# EAGLE design SelfBus JTAG_SWD Adapter (EAGLE 9.6.2)
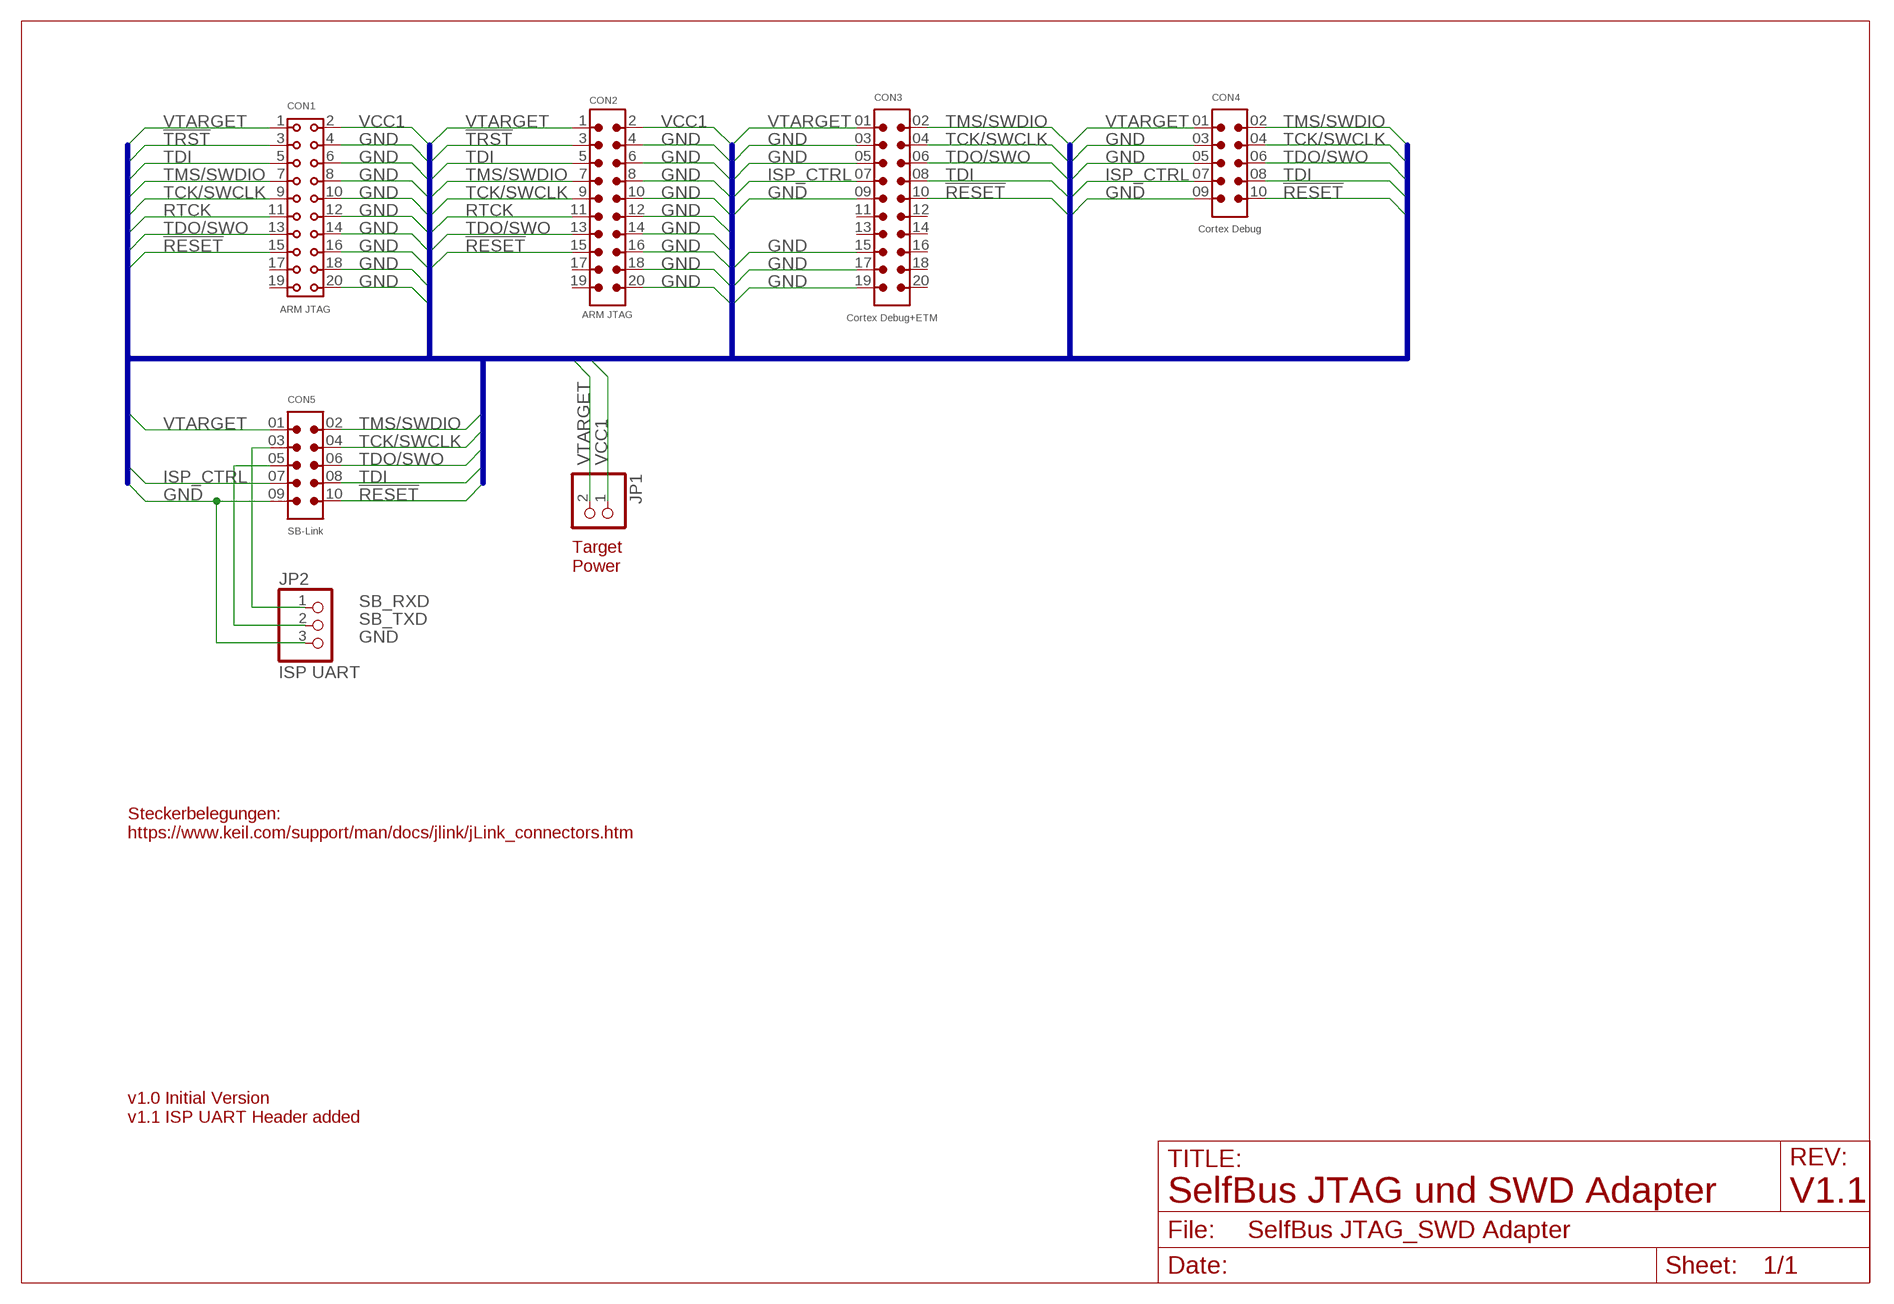
[diagram p0: schematic, sheet 1]

## Parts
CON1  ARM JTAG  SAMTEC-SSQ-110-02-X-D-RA  [SAMTEC-SSQ-110-02-X-D-RA]
CON2  ARM JTAG  6120XX21721_61202021721  [61202021721]
CON3  Cortex Debug+ETM  SHF-110-01-L-D-TH  [SAMTEC_SHF-110-01-L-D-TH]
CON4  Cortex Debug  SHF-105-01-X-D-TH  [SAMTEC_SHF-105-01-X-D-TH]
CON5  SB-Link  SAMTEC-LTMM-105-02-T-D  [SAMTEC-LTMM-105-02-T-D]
JP1  Target Power  PINHD-1X2  [1X02]
JP2  ISP UART  PINHD-1X3  [1X03]

## Nets
!RESET: CON1.15 CON2.15 CON3.10 CON4.10 CON5.10
!TRST: CON1.3 CON2.3
GND: CON1.4 CON1.6 CON1.8 CON1.10 CON1.12 CON1.14 CON1.16 CON1.18 CON1.20 CON2.4 CON2.6 CON2.8 CON2.10 CON2.12 CON2.14 CON2.16 CON2.18 CON2.20 CON3.03 CON3.05 CON3.09 CON3.15 CON3.17 CON3.19 CON4.03 CON4.05 CON4.09 CON5.09 JP2.3
ISP_CTRL: CON3.07 CON4.07 CON5.07
RTCK: CON1.11 CON2.11
SB_RXD: CON5.03 JP2.1
SB_TXD: CON5.05 JP2.2
TCK/SWCLK: CON1.9 CON2.9 CON3.04 CON4.04 CON5.04
TDI: CON1.5 CON2.5 CON3.08 CON4.08 CON5.08
TDO/SWO: CON1.13 CON2.13 CON3.06 CON4.06 CON5.06
TMS/SWDIO: CON1.7 CON2.7 CON3.02 CON4.02 CON5.02
VCC1: CON1.2 CON2.2 JP1.1
VTARGET: CON1.1 CON2.1 CON3.01 CON4.01 CON5.01 JP1.2
Unconnected: CON1.17 CON1.19 CON2.17 CON2.19 CON3.11 CON3.12 CON3.13 CON3.14 CON3.16 CON3.18 CON3.20

## Buses
JTAG:DBGACK,DBGRQ,GND,ISP_CTRL,!RESET,RTCK,TCK/SWCLK,TDI,TDO/SWO,TMS/SWDIO,!TRST,VCC1,VTARGET

## Notes on the sheet
- Target
  Power
- Steckerbelegungen:
  https://www.keil.com/support/man/docs/jlink/jLink_connectors.htm
- v1.0 Initial Version
  v1.1 ISP UART Header added
- SelfBus JTAG und SWD Adapter | V1.1

## Library data of the parts
CON1 = MyCon-Samtec:SAMTEC-SSQ-110-02-X-D-RA; LCSC2#: C124406; MOUSER#: 200-SSQ11002TDRA; PART#: Samtec SSQ-110-02-T-D-RA; PART2#: Ckmtw(Shenzhen Cankemeng) C124406
CON2 = MyCon-Würth:6120XX21721_61202021721: WR-BHD 2.54 mm Male Angled Box Header KIND PROPERTIES: Pitch 2.54 mm Gender:Male MATERIAL PROPERTIES: Insulator Material:PBT Insulator Flammability Rating UL94 V-0 Insulator Color:Black Contact Material :Copper Alloy Contact Plating :Gold Contact Type: Stamped GENERAL INFORMATION: Operating Temperature:-40 °C up to +125 °C Compliance:RoHS Working Voltage: 250 V (AC) Withstanding Voltage:500 V (AC) Contact Resistance: 20 mΩ Insulation Resistance:1000 MΩ CERTIFICATION: UL Approval:E323964 PACKAGING PROPERTIES Packaging :Tray <https://katalog.we-online.com/media/images/v2/o32888v209%20Family_WR-BHD_6120xx21721.jpg> Details see: https://katalog.we-online.com/en/em/BHD_2_54_MALE_ANGLED_BOX_HEADER_6120XX21721 Updated by Yingchun,Shan 2019-10-29 2019 (C) Würth Elektronik; LCSC3#: C9144; MOUSER#: 710-61202021721; MOUSER2#: 517-30320-5002; PART#: Würth 61202021721; PART2#: 3M 30320-5002HB; PART3#: BOOMELE(Boom Precision Elec) C9144
CON3 = MyCon-Samtec:SHF-110-01-L-D-TH; MOUSER#: 200-SHF11001LDTH; PART#: SHF-110-01-L-D-TH
CON4 = MyCon-Samtec:SHF-105-01-X-D-TH: Connector Header Through Hole 10 position 0.050" (1.27mm); LCSC2#: C239059; MOUSER#: 200-SHF10501LDTH; PART#: SHF-105-01-L-D-TH; PART2#: Amphenol ICC 20021111-00010T4LF
CON5 = MyCon-Samtec:SAMTEC-LTMM-105-02-T-D; LCSC3#: C5661; MOUSER#: 200-LTMM10502TD; MOUSER2#: 538-87831-1020; PART#: Samtec LTMM-105-02-T-D; PART2#: Molex 87831-1020; PART3#: BOOMELE(Boom Precision Elec) C5661
JP1 = pinhead:PINHD-1X2: PIN HEADER
JP2 = pinhead:PINHD-1X3: PIN HEADER

## Board
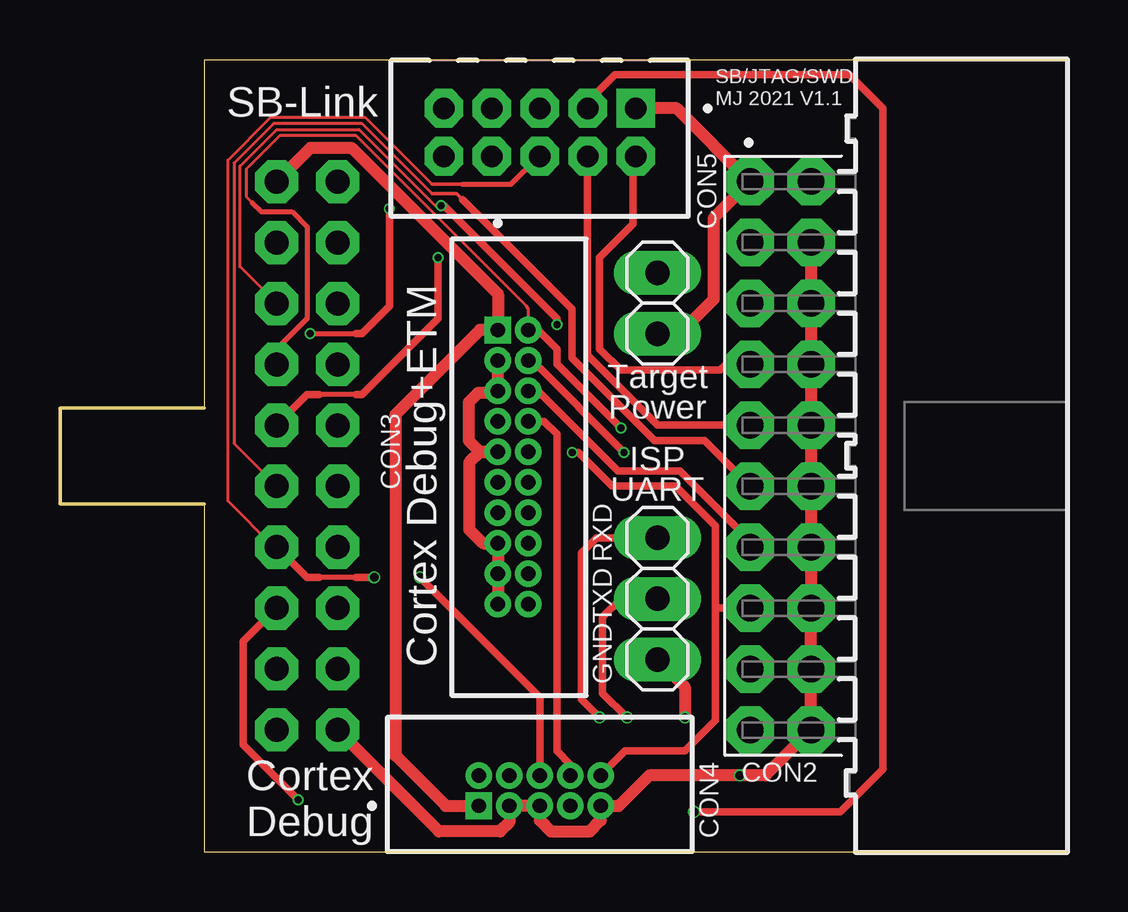
[diagram p1: board, top side]
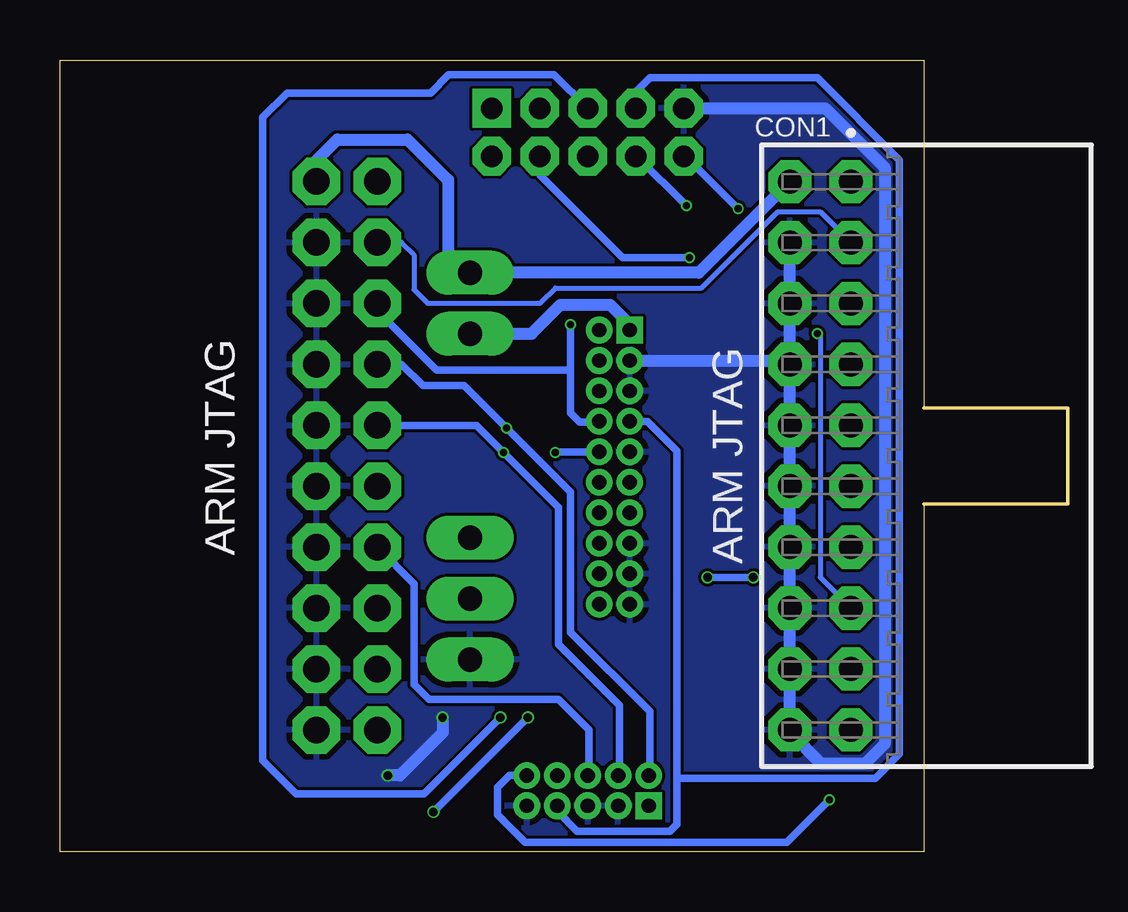
[diagram p2: board, bottom side, seen from below]

Size 42 x 33 mm. Coordinates in mm from the lower left corner, seen from the top.
Outline: 6,0 42,0 42,33 6,33 6,18.5 0,18.5 0,14.5 6,14.5 6,0
Copper layers (1*16): Top 0.035mm / dielectric 1.6mm / Bottom 0.035mm
Design rules "jlcpcb-2layers": minimum track width 5mil, minimum drill 0.3mm, track to track 5mil, track to pad 5mil, pad to pad 5mil, via to via 5mil, smd to smd 5mil, copper to edge 0.2mm, drill to drill 6mil, minimum pad ring 10mil, minimum via ring 3mil, stop-mask expansion 4mil, vias tented up to drill 0mil, thermal gap 10mil

### Footprints (pad centres in the part's own frame; a part is rotated, then mirrored left to right if it is on the bottom)
SAMTEC-SSQ-110-02-X-D-RA = drill 1 pad 1.676 octagon: 1 0,0; 2 0,-2.54; 3 2.54,0; 4 2.54,-2.54; 5 5.08,0; 6 5.08,-2.54; 7 7.62,0; 8 7.62,-2.54; 9 10.16,0; 10 10.16,-2.54; 11 12.7,0; 12 12.7,-2.54; 13 15.24,0; 14 15.24,-2.54; 15 17.78,0; 16 17.78,-2.54; 17 20.32,0; 18 20.32,-2.54; 19 22.86,0; 20 22.86,-2.54
61202021721 = drill 1.1 pad 1.676 octagon: 1 11.43,8.805; 2 11.43,6.265; 3 8.89,8.805; 4 8.89,6.265; 5 6.35,8.805; 6 6.35,6.265; 7 3.81,8.805; 8 3.81,6.265; 9 1.27,8.805; 10 1.27,6.265; 11 -1.27,8.805; 12 -1.27,6.265; 13 -3.81,8.805; 14 -3.81,6.265; 15 -6.35,8.805; 16 -6.35,6.265; 17 -8.89,8.805; 18 -8.89,6.265; 19 -11.43,8.805; 20 -11.43,6.265
SAMTEC_SHF-110-01-L-D-TH = drill 0.6 square: 01 0,0 | drill 0.6: 02 0,1.27; 03 1.27,0; 04 1.27,1.27; 05 2.54,0; 06 2.54,1.27; 07 3.81,0; 08 3.81,1.27; 09 5.08,0; 10 5.08,1.27; 11 6.35,0; 12 6.35,1.27; 13 7.62,0; 14 7.62,1.27; 15 8.89,0; 16 8.89,1.27; 17 10.16,0; 18 10.16,1.27; 19 11.43,0; 20 11.43,1.27
SAMTEC_SHF-105-01-X-D-TH = drill 0.6 square: 01 -2.54,-0.635 | drill 0.6: 02 -2.54,0.635; 03 -1.27,-0.635; 04 -1.27,0.635; 05 0,-0.635; 06 0,0.635; 07 1.27,-0.635; 08 1.27,0.635; 09 2.54,-0.635; 10 2.54,0.635
SAMTEC-LTMM-105-02-T-D = drill 0.9 square: 01 -4,-1 | drill 0.9 octagon: 02 -4,1; 03 -2,-1; 04 -2,1; 05 0,-1; 06 0,1; 07 2,-1; 08 2,1; 09 4,-1; 10 4,1
1X02 = drill 1.016 long: 1 -1.27,0; 2 1.27,0
1X03 = drill 1.016 long: 1 -2.54,0; 2 0,0; 3 2.54,0

### Placement (x,y rotation side)
CON1  9.03,27.93 270 bottom
CON2  37.58,16.5 90 top
CON3  18.25,21.74 270 top
CON4  20,2.54 0 top
CON5  20,29.98 180 top
JP1  24.91,22.86 270 top
JP2  24.91,10.54 270 top

### Tracks (layer width: path | path; a pad name or v marks a point on that pad's centre or on a via)
!RESET  (via drill 0.3)
  Top 0.127: CON1.15
  Top 0.203: 12.34,21.59 10.81,21.59 v10.43,21.59
  Top 0.305: v13.73,26.8 13.73,22.73 12.59,21.59 12.34,21.59 | v9.92,2.16 7.64,4.45 7.64,8.76 CON1.15 | v21.35,16.64 21.61,16.64 23,15.24 25.66,15.24 27.32,13.58 27.32,10.16 27.33,10.15 | CON2.15 27.33,10.15 | 27.33,10.15 27.33,5.47 26.05,4.19 23.56,4.19 CON4.10
  Bottom 0.127: CON1.15
  Bottom 0.203: v10.43,21.59 10.3,21.46 10.3,11.43 CON1.15
  Bottom 0.305: v13.73,26.8 15.89,28.96 CON5.10 | v9.92,2.16 11.7,0.38 22.62,0.38 23.77,1.52 23.77,2.67 23.26,3.17 CON4.10 | v21.35,16.64 21.33,16.66 CON3.10
!TRST
  Bottom 0.127: CON1.3
  Bottom 0.203: CON1.3 10.3,26.67 12.08,26.67 15.26,23.5 21.35,23.5 21.99,22.86 26.69,22.86 27.25,23.42 27.25,24.88 27.75,25.39 CON2.3
GND  (via drill 0.35)
  Top 0.508: CON1.20 15.8,0.84 18.35,0.84 18.73,1.22 CON4.03 CON4.05 20,1.29 20.45,0.84 22.09,0.84 22.54,1.29 CON4.09 23.3,1.91 24.57,3.17 v28.34,3.17 29.41,3.17 CON2.20 CON2.18 CON2.16 CON2.14 CON2.12 CON2.10 CON2.8 CON2.6 CON2.4 | CON3.03 CON3.05 18.17,19.12 17.43,19.12 17.03,18.72 17.03,17.14 17.51,16.66 | 17.51,16.66 CON3.09 17.51,16.66 | 17.51,16.66 17.06,16.21 17.06,13.43 17.64,12.85 CON3.15 CON3.17 CON3.19 | JP2.3 26.05,6.86 v26.05,5.59
  Bottom 0.127: CON1.18 | 11.56,4.97 11.57,4.95 CON1.20 | CON1.16 | CON1.14 | CON1.12 | CON1.10 | CON1.6 | CON1.8
  Bottom 0.508: CON5.09 10.1,30.98 7.62,28.51 7.62,4.49 8.45,3.66 10.25,3.66 11.56,4.97 11.57,4.98 CON1.20 CON1.18 CON1.16 CON1.14 CON1.12 CON1.10 CON1.8 | CON1.8 CON1.6 CON1.4 | CON3.03 11.73,20.47 CON1.8 | v26.05,5.59 26.05,4.95 27.83,3.17 v28.34,3.17
  pour Bottom: 6.49,32.51 41.55,32.51 41.55,0.38 6.49,0.38
ISP_CTRL
  Bottom 0.127: 16.27,3.3 16.27,3.05
  Bottom 0.305: CON3.07 17.51,17.93 16.27,16.69 16.27,3.3 16.27,1.14 16.57,0.84 20.44,0.84 21.27,1.67 CON4.07 | CON5.07 18,31.67 17.41,32.26 10.43,32.26 7,28.83 7,4.06 8.02,3.05 16.27,3.05
RTCK
  Top 0.127: 15.51,27.43 12.59,30.35 8.91,30.35 7.26,28.7 7.26,17.02 CON1.11
  Top 0.152: 15.51,27.43 16.53,27.43 16.78,27.18
  Top 0.305: 16.78,27.18 21.35,22.61 21.35,20.57 24.78,17.14 26.86,17.14 CON2.11
SB_RXD  (via drill 0.35)
  Top 0.305: JP2.1 22.37,13.08 21.73,12.45 21.73,6.35 v22.5,5.59 | v26.43,1.65 32.53,1.65 34.31,3.43 34.31,30.99 32.91,32.38 23.13,32.38 22,31.25 CON5.03
  Bottom 0.305: v26.43,1.65 v22.5,5.59
SB_TXD  (via drill 0.35)
  Top 0.152: 23.38,10.54 JP2.2
  Top 0.305: v23.64,5.59 22.62,6.6 22.62,9.78 23.38,10.54
  Bottom 0.305: CON5.05 21.4,32.38 25.8,32.38 26.56,31.62 32.53,31.62 33.54,30.61 33.54,3.81 32.15,2.41 26.81,2.41 v23.64,5.59
TCK/SWCLK  (via drill 0.3)
  Top 0.127: CON5.04 21.99,28.97 | 28.72,17.78 CON2.9 | CON1.9
  Top 0.203: 12.34,19.05 10.81,19.05
  Top 0.305: v23.51,16.64 19.67,20.48 19.66,20.47 CON3.04 | 21.99,28.97 21.99,20.7 24.91,17.78 28.72,17.78 | CON1.9 10.3,19.05 10.81,19.05 | 12.34,19.05 12.59,19.05 15.76,22.23 v15.76,24.77
  Bottom 0.305: CON4.04 18.68,3.22 18.68,6.1 21.23,8.64 21.23,14.35 v23.51,16.64 24.64,17.77 CON2.9 | v15.76,24.77 18.56,24.77 22,28.21 CON5.04
TDI  (via drill 0.3)
  Top 0.127: v15.89,26.92 15.64,26.92 12.46,30.1 9.03,30.1 7.51,28.57 7.51,24.38 CON1.5
  Top 0.305: CON4.08 21.27,3.64 20.72,4.19 20.72,17.4 20.19,17.93 CON3.08 | v20.72,21.97 20.72,22.23 16.02,26.92 v15.89,26.92
  Bottom 0.305: v15.89,26.92 17.92,28.96 CON5.08 | CON3.08 19.65,17.93 19.67,17.91 19.83,17.91 20.34,17.91 20.72,18.29 20.72,20.07 | 20.72,20.07 26.3,20.07 28.77,22.53 CON2.5 | v20.72,21.97 20.72,20.07
TDO/SWO  (via drill 0.35)
  Top 0.127: 19.57,19.18 CON3.06 | 15.51,27.81 12.72,30.61 8.78,30.61 7,28.83 7,14.61 8.92,12.69 CON1.13 | 19.95,28.96 CON5.06
  Top 0.152: 15.51,27.81 16.78,27.81
  Top 0.203: 19.95,28.96 18.81,27.81 16.78,27.81 | 12.34,11.43 10.81,11.43
  Top 0.305: 19.57,19.18 19.95,19.18 23.26,15.88 25.2,15.88 25.21,15.87 25.85,15.87 28.77,12.94 CON2.13 | CON4.06 20,6.43 v15,11.43 | v13.1,11.43 12.34,11.43 | 10.81,11.43 10.29,11.43 CON1.13
  Bottom 0.305: CON2.13 27.25,11.17 27.25,6.97 26.61,6.34 21.21,6.34 19.95,5.08 19.95,3.22 CON4.06 | v15,11.43 v13.1,11.43
TMS/SWDIO  (via drill 0.3)
  Top 0.127: 23.89,28.96 CON5.02 | 8.02,27.05 7.76,27.3 7.76,28.45 9.16,29.84 12.34,29.84 19.45,22.73 19.52,22.63 CON3.02 | CON1.7
  Top 0.203: CON1.7 9.03,20.95 10.3,22.23 10.3,26.04 9.67,26.67 8.4,26.67 8.02,27.05
  Top 0.305: 23.89,28.96 23.89,26.16 22.5,24.77 22.5,20.95 23.38,20.07 27.51,20.07 27.75,20.31 CON2.7 | CON3.02 19.93,21.74 20.72,20.95 20.72,20.32 v23.38,17.65
  Bottom 0.305: CON4.02 17.41,3.22 17.41,5.84 20.72,9.14 20.72,14.99 v23.38,17.65 24.08,18.35 25.15,19.42 26.86,19.42 27.75,20.31 CON2.7
VCC1
  Bottom 0.508: CON1.2 15.37,24.13 23.99,24.13 JP1.1 25.82,24.13 25.82,27.99 27.51,29.68 30.45,29.68 31.31,28.82 CON2.2
VTARGET
  Top 0.508: CON1.1 10.44,29.34 12.16,29.34 18.25,23.24 CON3.01 17.51,21.74 13.98,18.21 13.98,4 16.09,1.91 CON4.01 | CON5.01 25.71,30.98 CON2.1 27.25,26.41 27.25,23.01 25.82,21.59 JP1.2
  Bottom 0.508: JP1.2 22.34,21.59 21.13,22.8 19.08,22.8 18.25,21.97 CON3.01

### Text on the board
tPlace: SB/JTAG/SWD / MJ 2021 V1.1 | RXD | TXD | GND
tNames: Target / Power | ISP / UART | Cortex / Debug